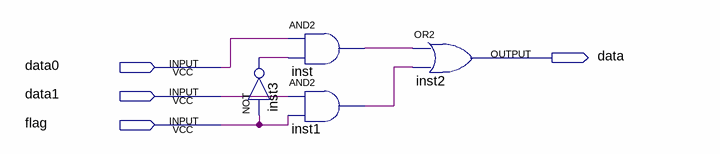
[diagram p0: schematic sheet]
// Quartus schematic selector.bdf as structural Verilog: 4 symbols, 4 pins
module selector (
  input  data0,
  input  data1,
  input  flag,
  output data
);

  wire inst1_out, inst3_out, inst_out;

  not inst3 (inst3_out, flag);
  and inst (inst_out, data0, inst3_out);
  and inst1 (inst1_out, data1, flag);
  or inst2 (data, inst_out, inst1_out);
endmodule
